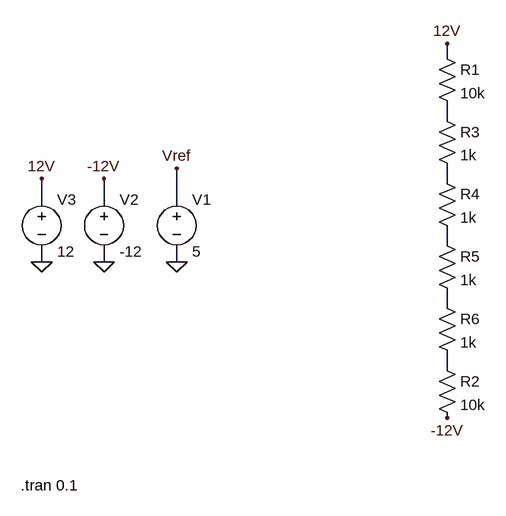
[diagram p0: schematic Draft2.asc]
Draft2.asc, the LTspice schematic file:
Version 4.1
SHEET 1 880 680
WIRE 560 -128 560 -144
WIRE 560 -32 560 -48
WIRE 560 64 560 48
WIRE -64 96 -64 64
WIRE 32 96 32 64
WIRE 144 96 144 48
WIRE 560 160 560 144
WIRE -64 192 -64 176
WIRE 32 192 32 176
WIRE 144 192 144 176
WIRE 560 256 560 240
WIRE 560 352 560 336
FLAG 144 192 0
FLAG 144 48 Vref
FLAG -64 192 0
FLAG 32 192 0
FLAG -64 64 12V
FLAG 32 64 -12V
FLAG 560 -144 12V
FLAG 560 432 -12V
SYMBOL voltage 144 80 R0
WINDOW 123 0 0 Left 0
WINDOW 39 0 0 Left 0
SYMATTR InstName V1
SYMATTR Value 5
SYMBOL voltage 32 80 R0
WINDOW 123 0 0 Left 0
WINDOW 39 0 0 Left 0
SYMATTR InstName V2
SYMATTR Value -12
SYMBOL voltage -64 80 R0
WINDOW 123 0 0 Left 0
WINDOW 39 0 0 Left 0
SYMATTR InstName V3
SYMATTR Value 12
SYMBOL res 544 -144 R0
SYMATTR InstName R1
SYMATTR Value 10k
SYMBOL res 544 336 R0
SYMATTR InstName R2
SYMATTR Value 10k
SYMBOL res 544 -48 R0
SYMATTR InstName R3
SYMATTR Value 1k
SYMBOL res 544 48 R0
SYMATTR InstName R4
SYMATTR Value 1k
SYMBOL res 544 144 R0
SYMATTR InstName R5
SYMATTR Value 1k
SYMBOL res 544 240 R0
SYMATTR InstName R6
SYMATTR Value 1k
TEXT -96 536 Left 2 !.tran 0.1

The netlist it stands for:
* Draft2.asc
V1 Vref 0 5
V2 -12V 0 -12
V3 12V 0 12
R1 12V N001 10k
R2 N005 -12V 10k
R3 N001 N002 1k
R4 N002 N003 1k
R5 N003 N004 1k
R6 N004 N005 1k
.tran 0.1
.backanno
.end